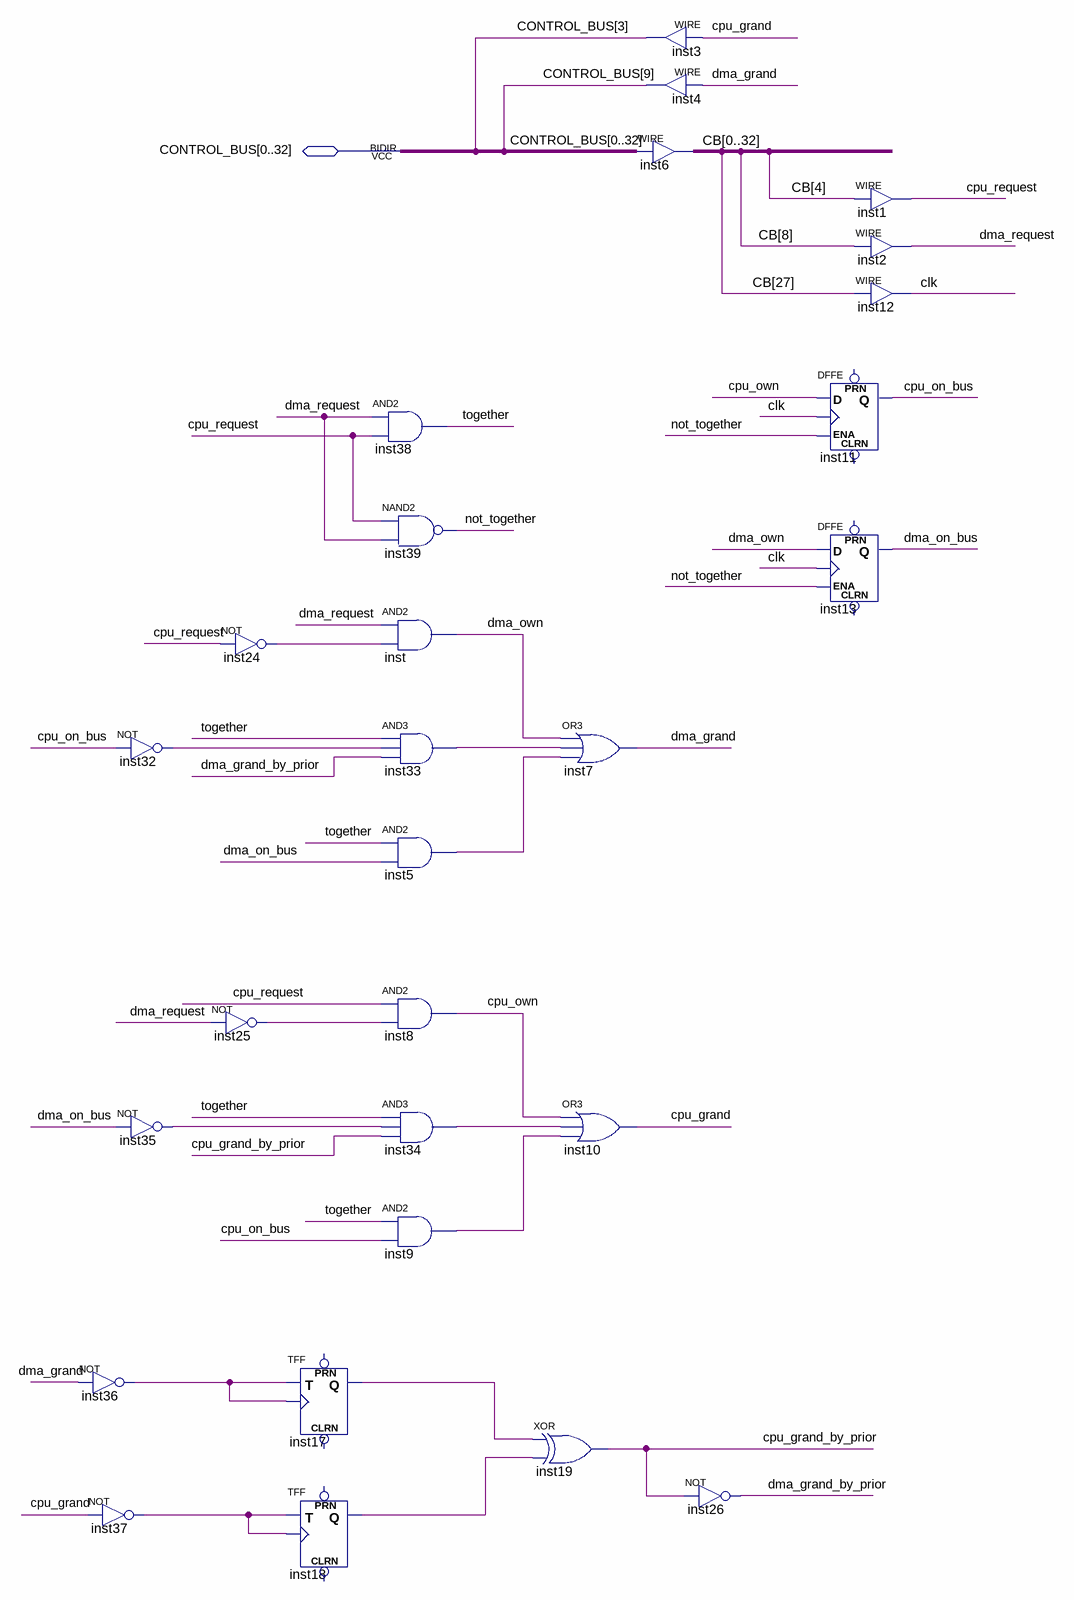
[diagram p0: schematic sheet]
// Quartus schematic arbiter.bdf as structural Verilog: 28 symbols, 1 pins
module arbiter (
  inout  [0:32] CONTROL_BUS
);

  wire clk, cpu_grand, cpu_grand_by_prior, cpu_on_bus, cpu_own, cpu_request, dma_grand, dma_grand_by_prior,
       dma_on_bus, dma_own, dma_request, inst5_out, inst9_out, inst17_q, inst18_q, inst24_out, inst25_out,
       inst32_out, inst33_out, inst34_out, inst35_out, inst36_out, inst37_out, not_together, together;
  wire [32:0] CB;

  not inst32 (inst32_out, cpu_on_bus);
  not inst35 (inst35_out, dma_on_bus);
  not inst36 (inst36_out, dma_grand);
  not inst37 (inst37_out, cpu_grand);
  not inst25 (inst25_out, dma_request);
  not inst24 (inst24_out, cpu_request);
  TFF inst17 (.T(inst36_out), .CLK(inst36_out), .Q(inst17_q));  // open: PRN, CLRN
  TFF inst18 (.T(inst37_out), .CLK(inst37_out), .Q(inst18_q));  // open: PRN, CLRN
  and inst38 (together, dma_request, cpu_request);
  nand inst39 (not_together, cpu_request, dma_request);
  and inst (dma_own, dma_request, inst24_out);
  and inst33 (inst33_out, together, inst32_out, dma_grand_by_prior);
  and inst5 (inst5_out, together, dma_on_bus);
  and inst8 (cpu_own, cpu_request, inst25_out);
  and inst34 (inst34_out, together, inst35_out, cpu_grand_by_prior);
  and inst9 (inst9_out, together, cpu_on_bus);
  or inst7 (dma_grand, dma_own, inst33_out, inst5_out);
  or inst10 (cpu_grand, cpu_own, inst34_out, inst9_out);
  xor inst19 (cpu_grand_by_prior, inst17_q, inst18_q);
  assign CONTROL_BUS[3] = cpu_grand;  // WIRE inst3
  assign CONTROL_BUS[9] = dma_grand;  // WIRE inst4
  assign {CB[0], CB[1], CB[2], CB[3], CB[4], CB[5], CB[6], CB[7], CB[8], CB[9], CB[10], CB[11], CB[12], CB[13], CB[14], CB[15], CB[16], CB[17], CB[18], CB[19], CB[20], CB[21], CB[22], CB[23], CB[24], CB[25], CB[26], CB[27], CB[28], CB[29], CB[30], CB[31], CB[32]} = CONTROL_BUS;  // WIRE inst6
  not inst26 (dma_grand_by_prior, cpu_grand_by_prior);
  DFFE inst11 (.D(cpu_own), .CLK(clk), .ENA(not_together), .Q(cpu_on_bus));  // open: PRN, CLRN
  DFFE inst13 (.D(dma_own), .CLK(clk), .ENA(not_together), .Q(dma_on_bus));  // open: PRN, CLRN
  assign cpu_request = CB[4];  // WIRE inst1
  assign dma_request = CB[8];  // WIRE inst2
  assign clk = CB[27];  // WIRE inst12
endmodule
